# Altium schematic sheet 17-ECP5_FPGA_2.SchDoc
size B; SheetNumber: 12; SheetTotal: 14
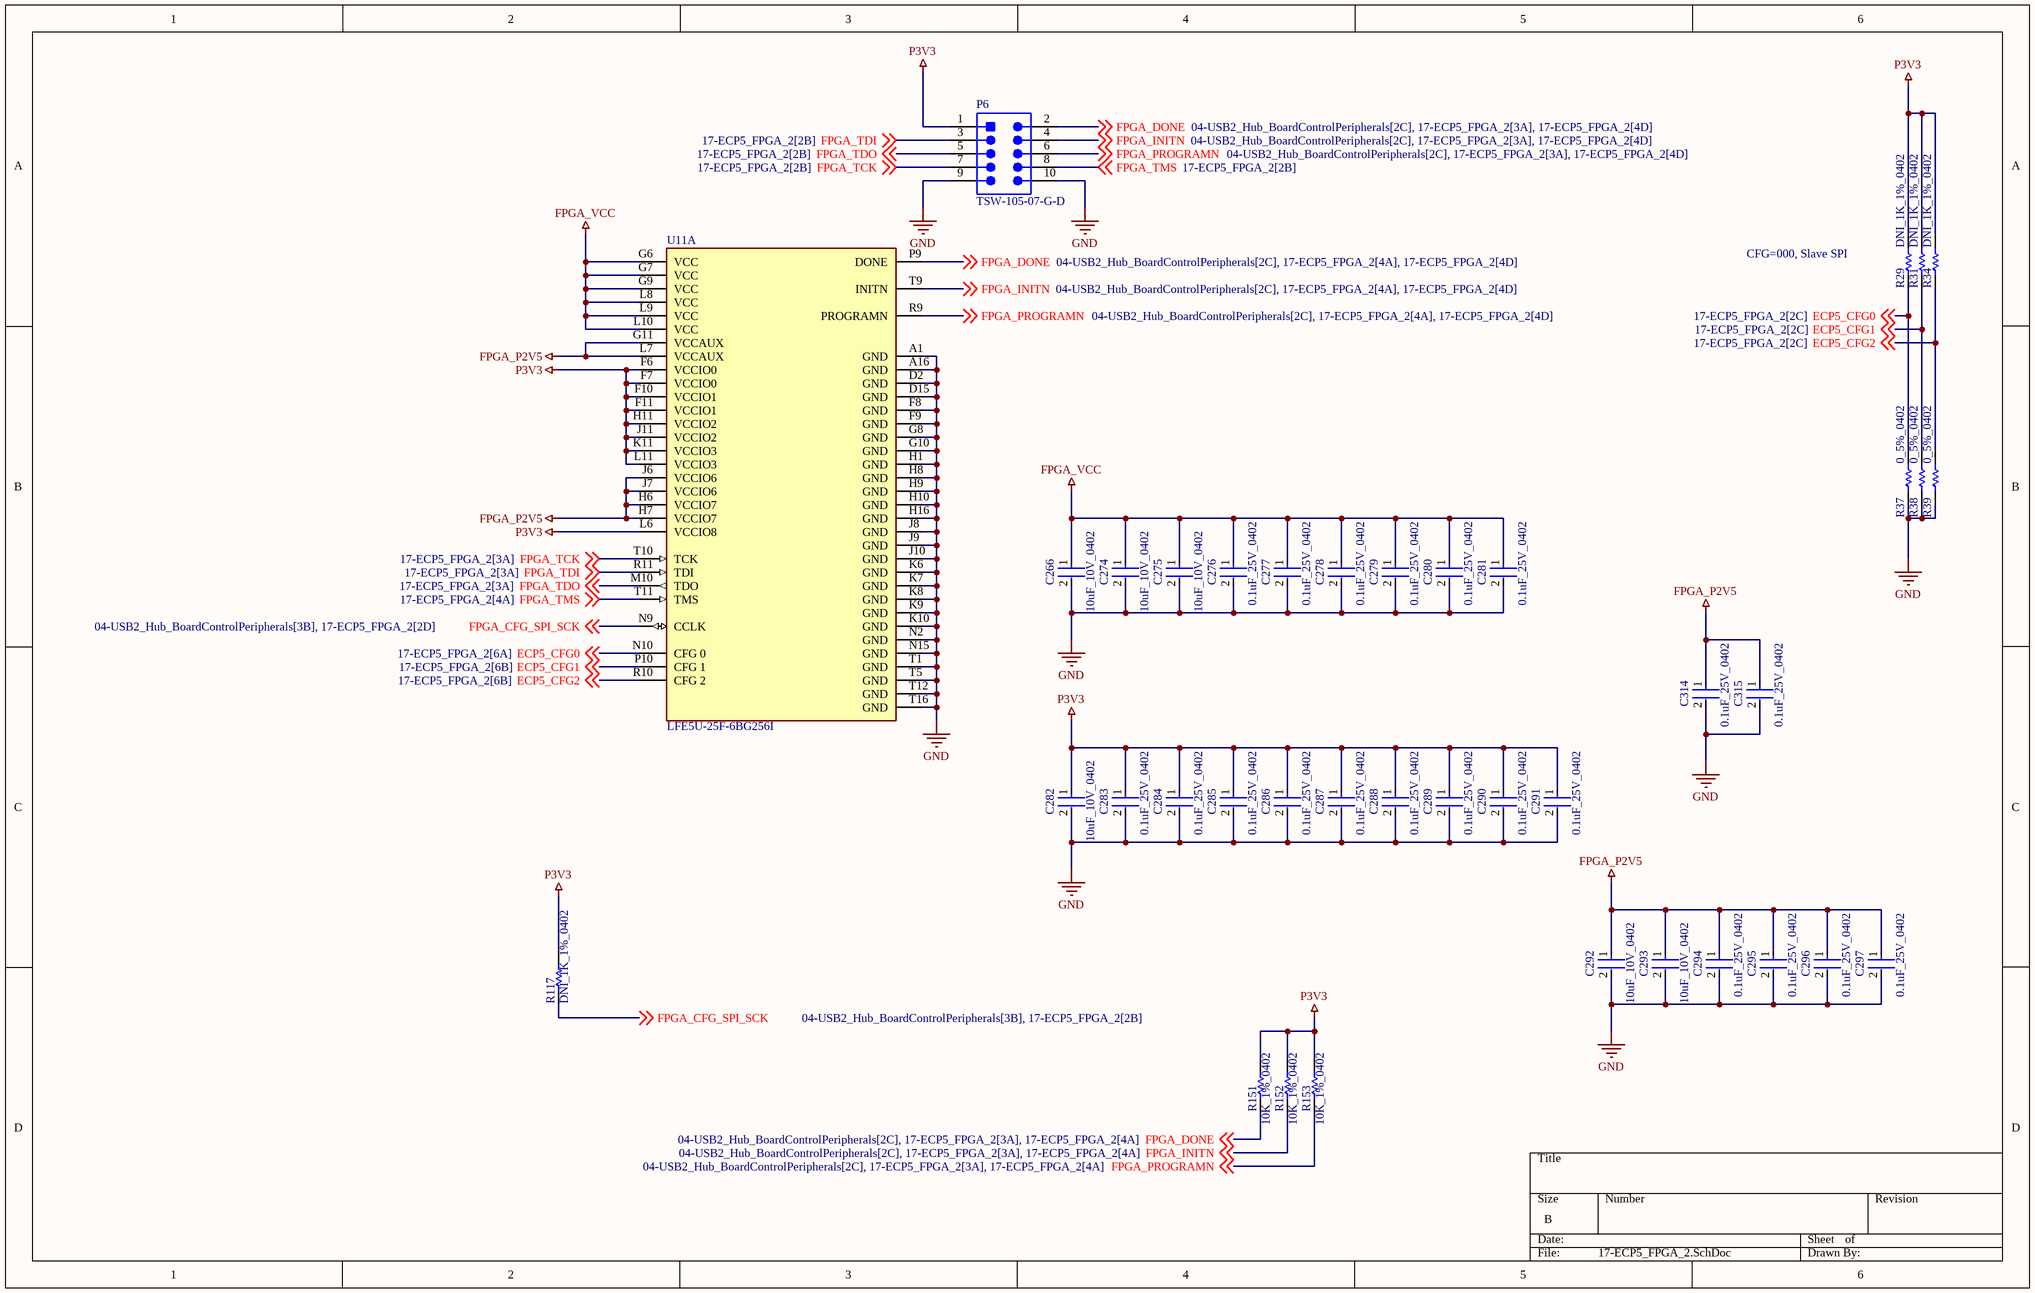
[diagram p0: 17-ECP5_FPGA_2.SchDoc]

## Parts
C266  10uF_10V_0402  [FP-CL05A106MP5NUNC-MFG]
C274  10uF_10V_0402  [FP-CL05A106MP5NUNC-MFG]
C275  10uF_10V_0402  [FP-CL05A106MP5NUNC-MFG]
C276  0.1uF_25V_0402  [FP-0402-L_1_0_1-W_0_5_0_1-IPC_C]
C277  0.1uF_25V_0402  [FP-0402-L_1_0_1-W_0_5_0_1-IPC_C]
C278  0.1uF_25V_0402  [FP-0402-L_1_0_1-W_0_5_0_1-IPC_C]
C279  0.1uF_25V_0402  [FP-0402-L_1_0_1-W_0_5_0_1-IPC_C]
C280  0.1uF_25V_0402  [FP-0402-L_1_0_1-W_0_5_0_1-IPC_C]
C281  0.1uF_25V_0402  [FP-0402-L_1_0_1-W_0_5_0_1-IPC_C]
C282  10uF_10V_0402  [FP-CL05A106MP5NUNC-MFG]
C283  0.1uF_25V_0402  [FP-0402-L_1_0_1-W_0_5_0_1-IPC_C]
C284  0.1uF_25V_0402  [FP-0402-L_1_0_1-W_0_5_0_1-IPC_C]
C285  0.1uF_25V_0402  [FP-0402-L_1_0_1-W_0_5_0_1-IPC_C]
C286  0.1uF_25V_0402  [FP-0402-L_1_0_1-W_0_5_0_1-IPC_C]
C287  0.1uF_25V_0402  [FP-0402-L_1_0_1-W_0_5_0_1-IPC_C]
C288  0.1uF_25V_0402  [FP-0402-L_1_0_1-W_0_5_0_1-IPC_C]
C289  0.1uF_25V_0402  [FP-0402-L_1_0_1-W_0_5_0_1-IPC_C]
C290  0.1uF_25V_0402  [FP-0402-L_1_0_1-W_0_5_0_1-IPC_C]
C291  0.1uF_25V_0402  [FP-0402-L_1_0_1-W_0_5_0_1-IPC_C]
C292  10uF_10V_0402  [FP-CL05A106MP5NUNC-MFG]
C293  10uF_10V_0402  [FP-CL05A106MP5NUNC-MFG]
C294  0.1uF_25V_0402  [FP-0402-L_1_0_1-W_0_5_0_1-IPC_C]
C295  0.1uF_25V_0402  [FP-0402-L_1_0_1-W_0_5_0_1-IPC_C]
C296  0.1uF_25V_0402  [FP-0402-L_1_0_1-W_0_5_0_1-IPC_C]
C297  0.1uF_25V_0402  [FP-0402-L_1_0_1-W_0_5_0_1-IPC_C]
C314  0.1uF_25V_0402  [FP-0402-L_1_0_1-W_0_5_0_1-IPC_C]
C315  0.1uF_25V_0402  [FP-0402-L_1_0_1-W_0_5_0_1-IPC_C]
P6  TSW-105-07-G-D  [SMTC-TSW-105-07-G-D_V]
R29  DNI_1K_1%_0402  [RESC1005X40X25LL05T10]  (no BOM)
R31  DNI_1K_1%_0402  [RESC1005X40X25LL05T10]  (no BOM)
R34  DNI_1K_1%_0402  [RESC1005X40X25LL05T10]  (no BOM)
R37  0_5%_0402  [RESC1005X40X25LL10T10]
R38  0_5%_0402  [RESC1005X40X25LL10T10]
R39  0_5%_0402  [RESC1005X40X25LL10T10]
R117  DNI_1K_1%_0402  [RESC1005X40X25LL05T10]  (no BOM)
R151  10K_1%_0402  [RESC1005X40X25NL10T10]
R152  10K_1%_0402  [RESC1005X40X25NL10T10]
R153  10K_1%_0402  [RESC1005X40X25NL10T10]
U11  LFE5U-25F-6BG256I  [FP-LFE5U-25F-6BG256I-MFG]  (part A of 5)

## Nets
FPGA_P2V5: C292.1 C293.1 C294.1 C295.1 C296.1 C297.1 C314.1 C315.1 U11.G11(VCCAUX) U11.H6(VCCIO7) U11.H7(VCCIO7) U11.J6(VCCIO6) U11.J7(VCCIO6) U11.L7(VCCAUX)
FPGA_VCC: C266.1 C274.1 C275.1 C276.1 C277.1 C278.1 C279.1 C280.1 C281.1 U11.G6(VCC) U11.G7(VCC) U11.G9(VCC) U11.L8(VCC) U11.L9(VCC) U11.L10(VCC)
GND: C266.2 C274.2 C275.2 C276.2 C277.2 C278.2 C279.2 C280.2 C281.2 C282.2 C283.2 C284.2 C285.2 C286.2 C287.2 C288.2 C289.2 C290.2 C291.2 C292.2 C293.2 C294.2 C295.2 C296.2 C297.2 C314.2 C315.2 P6.9 P6.10 R37.1 R38.1 R39.1 U11.A1(GND) U11.A16(GND) U11.D2(GND) U11.D15(GND) U11.F8(GND) U11.F9(GND) U11.G8(GND) U11.G10(GND) U11.H1(GND) U11.H8(GND) U11.H9(GND) U11.H10(GND) U11.H16(GND) U11.J8(GND) U11.J9(GND) U11.J10(GND) U11.K6(GND) U11.K7(GND) U11.K8(GND) U11.K9(GND) U11.K10(GND) U11.N2(GND) U11.N15(GND) U11.T1(GND) U11.T5(GND) U11.T12(GND) U11.T16(GND)
P3V3: C282.1 C283.1 C284.1 C285.1 C286.1 C287.1 C288.1 C289.1 C290.1 C291.1 P6.1 R29.2 R31.2 R34.2 R117.2 R151.2 R152.2 R153.2 U11.F6(VCCIO0) U11.F7(VCCIO0) U11.F10(VCCIO1) U11.F11(VCCIO1) U11.H11(VCCIO2) U11.J11(VCCIO2) U11.K11(VCCIO3) U11.L6(VCCIO8) U11.L11(VCCIO3)
ECP5_CFG0: R29.1 R37.2 U11.N10(CFG_0) ; off-sheet ECP5_CFG0
ECP5_CFG1: R31.1 R38.2 U11.P10(CFG_1) ; off-sheet ECP5_CFG1
ECP5_CFG2: R34.1 R39.2 U11.R10(CFG_2) ; off-sheet ECP5_CFG2
FPGA_CFG_SPI_SCK: R117.1 U11.N9(CCLK) ; off-sheet FPGA_CFG_SPI_SCK
FPGA_DONE: P6.2 R151.1 U11.P9(DONE) ; off-sheet FPGA_DONE
FPGA_INITN: P6.4 R152.1 U11.T9(INITN) ; off-sheet FPGA_INITN
FPGA_PROGRAMN: P6.6 R153.1 U11.R9(PROGRAMN) ; off-sheet FPGA_PROGRAMN
FPGA_TCK: P6.7 U11.T10(TCK) ; off-sheet FPGA_TCK
FPGA_TDI: P6.3 U11.R11(TDI) ; off-sheet FPGA_TDI
FPGA_TDO: P6.5 U11.M10(TDO) ; off-sheet FPGA_TDO
FPGA_TMS: P6.8 U11.T11(TMS) ; off-sheet FPGA_TMS

## Notes on the sheet
- CFG=000, Slave SPI

## Library data of the parts
C266 C274 C275 C282 C292 C293 = CMP-13271-000002-1: CAP CER 10UF 10V X5R 0402; Manufacturer Part Number: CL05A106MP5NUNC; Manufacturer: Samsung; Temperature Coefficient: 15%; Tolerance: 20%; Material: Ceramic; Octopart: https://octopart.com/cl05a106mp5nunc-samsung-22457395; Voltage Rating: 10V; RoHS: TRUE; Value: 10uF; Height: 0.7mm; Digikey Description: CAP CER 10UF 10V X5R 0402; Automotive: No; Package: CL05A106MP5NUNC; Device Class L1: Passive Components; Capacitance: 10uF; Temperature Range High: +85°C; ComponentLink2Description: Datasheet; Device Class L2: Capacitors; Temperature Characteristic: X5R; Temperature: -55°C to +85°C; ComponentLink2URL: http://www.samsungsem.com/kr/support/product-search/mlcc/__icsFiles/afieldfile/2019/05/10/19-CL05A106MP5NUNC.pdf; Device Class L3: Ceramic Capacitors; Category: Cap; Temperature Range Low: -55°C; Ipc Land Pattern Name: CAPC10050X50; Lead Free: Yes
C276-C281 C283-C291 C294-C297 C314 C315 = CMP-2008-02519-2: General Purpose Ceramic Capacitor, 0402, 100nF, 10%, X7R, 15%, 25V; Package Quantity: 1; Capacitance: 100nF; Min Operating Temperature: -55°C; Voltage: 25V; Voltage Rating: 25V; Construction: Flat; Max Operating Temperature: 125°C; Radiation Hardening: No; Depth: 0.5mm; Thickness: 0.022inch; Voltage Rating (DC): 25V; Number of Pins: 2; Lead Free: Lead Free; Series: -; REACH SVHC: No SVHC; Length: 1mm; Dielectric: X7R; RoHS Compliant: Yes; Mount: Surface Mount; Packaging: Tape and Reel; Case/Package: 0402; Case Code (Imperial): 0402; Termination: SMD/SMT; Width: 0.02inch; Case Code (Metric): 1005; Tolerance: 10%
P6 = CMP-2000-07330-1: Post Terminal Strip Assembly, Pitch 2.54 mm, 2 x 5 Position, Height 8.58 mm, Tail Length 2.54 mm, -55 to 125 degC, RoHS, Bulk; Manufacturer: Samtec-Inc.; Connector Type: Header,Unshrouded; Number of Positions Loaded: All; Pitch: 0.100"(2.54mm); Number of Positions: 10; Package Reference: TSW-105-07-G-D; Mounting Technology: ThroughHole; Datasheet URL: http://suddendocs.samtec.com/prints/tsw-xxx-xx-xxx-x-xx-xxx-mkt.pdf; Termination: Solder; Packaging: Bulk; Number of Rows: 2; Contact Finish: Gold; Mounting Type: ThroughHole; Features: -; Color: Black; Category: Connectors,Interconnects; Family: RectangularConnectors-Headers,MalePins; Manufacturer URL: http://www.samtec.com/; Series: TSW; Fastening Type: -; Package URL: http://suddendocs.samtec.com/prints/tsw-xxx-xx-x-x-xx-xxx-footprint.pdf; Row Spacing: 0.100"(2.54mm); Contact Mating Length: 0.230"(5.84mm); Contact Finish Thickness: 10µin(0.25µm); Contact Type: MalePin; Package Description: Male Header, Pitch 2.54 mm, 2 x 5 Position, Height 8.58 mm, Tail Length 2.54 mm; Datasheet Version: Rev. DO, 08/1988
R29 R31 R34 R117 = CMP-2002-03045-1: Part Number: CRCW04021K00FKEDHP; Manufacturer: Vishay Dale
R37-R39 = CMP-2002-04569-1: Manufacturer: KOA Speer; Part Number: RK73Z1ETTP
R151-R153 = CMP-2002-04694-1: Manufacturer: Bourns; Part Number: CR0402-FX-1002GLF
U11 = CMP-17932-000009-1: IC FPGA 197 I/O 256CABGA; RAM Size: 1032192b; Number of Logic Elements/Cells: 24000; Number of Logic Blocks (LABs): 6000; Number of I/Os: 197; Number of Pins: 256; Mount: Surface Mount; Max Operating Temperature: 100°C; RoHS Compliant: Yes; Min Operating Temperature: -40°C